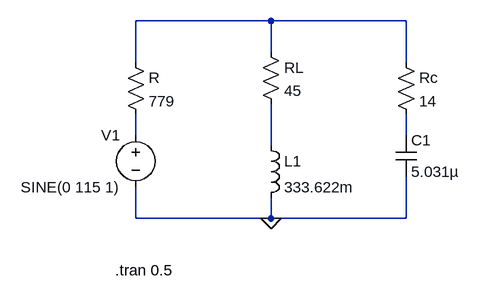
[diagram p0: schematic Var72_Parallel.asc]
Var72_Parallel.asc, the LTspice schematic file:
Version 4
SHEET 1 880 680
WIRE 192 -432 -16 -432
WIRE 400 -432 192 -432
WIRE 192 -384 192 -432
WIRE -16 -368 -16 -432
WIRE 400 -368 400 -432
WIRE -16 -256 -16 -288
WIRE 400 -256 400 -288
WIRE 192 -240 192 -304
WIRE -16 -128 -16 -176
WIRE 192 -128 192 -160
WIRE 192 -128 -16 -128
WIRE 400 -128 400 -192
WIRE 400 -128 192 -128
FLAG 192 -128 0
SYMBOL voltage -16 -272 M0
WINDOW 123 0 0 Left 0
WINDOW 39 0 0 Left 0
SYMATTR InstName V1
SYMATTR Value SINE(0 115 1)
SYMBOL res -32 -384 R0
SYMATTR InstName R
SYMATTR Value 779
SYMBOL ind 176 -256 R0
SYMATTR InstName L1
SYMATTR Value 333.622m
SYMBOL res 384 -384 R0
SYMATTR InstName Rc
SYMATTR Value 14
SYMBOL cap 384 -256 R0
SYMATTR InstName C1
SYMATTR Value 5.031µ
SYMBOL res 176 -400 R0
SYMATTR InstName RL
SYMATTR Value 45
TEXT -48 -48 Left 2 !.tran 0.5

The netlist it stands for:
* Var72_Parallel.asc
V1 N002 0 SINE(0 115 1)
R N001 N002 779
L1 N004 0 333.622m
Rc N001 N003 14
C1 N003 0 5.031µ
RL N001 N004 45
.tran 0.5
.backanno
.end